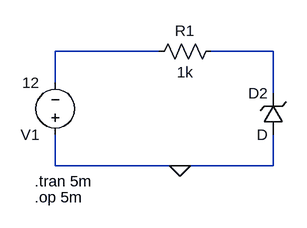
[diagram p0: schematic zener.asc]
zener.asc, the LTspice schematic file:
Version 4
SHEET 1 880 680
WIRE 240 96 80 96
WIRE 416 96 320 96
WIRE 80 144 80 96
WIRE 416 160 416 96
WIRE 80 272 80 224
WIRE 272 272 80 272
WIRE 416 272 416 224
WIRE 416 272 272 272
FLAG 272 272 0
SYMBOL voltage 80 240 R180
WINDOW 123 0 0 Left 0
WINDOW 39 0 0 Left 0
SYMATTR InstName V1
SYMATTR Value 12
SYMBOL res 224 112 R270
WINDOW 0 32 56 VTop 2
WINDOW 3 0 56 VBottom 2
SYMATTR InstName R1
SYMATTR Value 1k
SYMBOL zener 432 224 R180
WINDOW 0 24 64 Left 2
WINDOW 3 24 0 Left 2
SYMATTR InstName D2
TEXT 48 296 Left 2 !.tran 5m
TEXT 48 320 Left 2 !.op 5m

The netlist it stands for:
* zener.asc
V1 0 N001 12
R1 N001 N002 1k
D2 0 N002 D
.model D D
.lib standard.dio
.tran 5m
.op 5m
.backanno
.end